# EAGLE design EMS esp32 wifi v2.4 (eagle v7) (EAGLE 7.7.0)
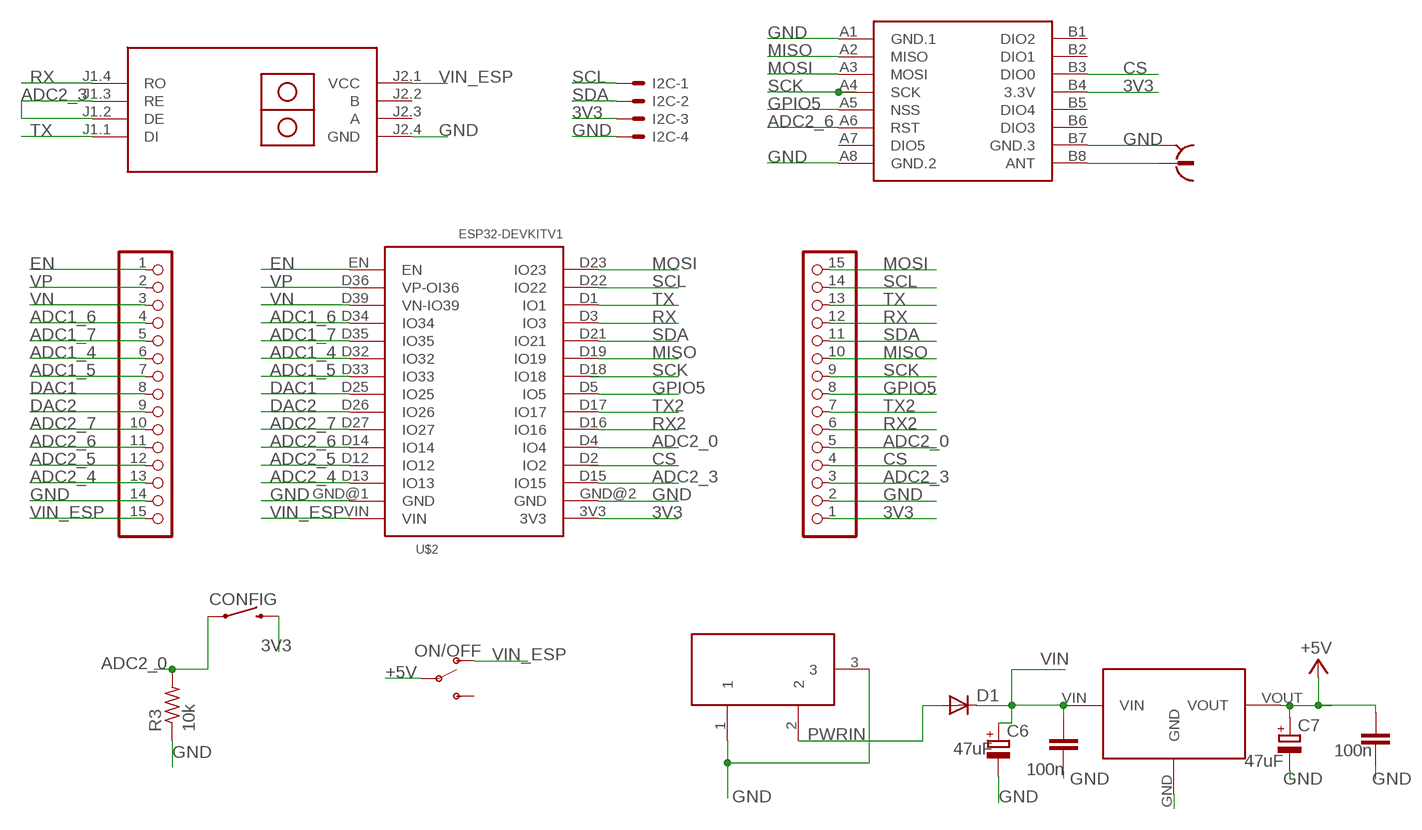
[diagram p0: schematic, sheet 1]

## Parts
C5  100n  C-EUC1206  [C1206]
C6  47uF  CPOL-EUD  [PANASONIC_D]
C7  47uF  CPOL-EUD  [PANASONIC_D]
C14  100n  C-EUC1206  [C1206]
CONFIG  MOMENTARY-SWITCH-SPST-PTH-6.0MM  [TACTILE_SWITCH_PTH_6.0MM]
D1  DIODE-SMB  [SMB]
I2C  22-23-2041  [22-23-2041]
JP1  PINHD-1X15  [1X15]
JP2  PINHD-1X15  [1X15]
ON/OFF  SWITCH-SPDT-PTH-11.6X4.0MM  [SWITCH_SPDT_PTH_11.6X4.0MM]
R3  10k  R-US_0204/7  [0204/7]
RFM95  WIRELESS-LORA-RFM95W#SMD  [WIRELESS-LORA-RFM95W#SMD]
U$1  RS485-TTL-CONVERTER  [RS485-TTL-CONVERTER]
U$2  ESP32DEVKITV1  [ESP32-DEVKITV1]
U$3  SMARTPRJ_POWERSUPPLY_DC21MMX  [SMARTPRJ_POWERSUPPLY_DC-21MM]
U$4  7805-TO263_7805  [7805-TO263_TO263]
X1  734120110  [734120110]

## Nets
3V3: CONFIG.3 I2C.3 JP2.1 RFM95.B4(3.3V) U$2.3V3
+5V [usbvcc]: C7.+ C14.2 ON/OFF.2(P) U$4.VOUT
ADC1_4: JP1.6 U$2.D32(IO32)
ADC1_5: JP1.7 U$2.D33(IO33)
ADC1_6: JP1.4 U$2.D34(IO34)
ADC1_7: JP1.5 U$2.D35(IO35)
ADC2_0: CONFIG.1 JP2.5 R3.2 U$2.D4(IO4)
ADC2_3: JP2.3 U$1.J1.2(DE) U$1.J1.3(RE) U$2.D15(IO15)
ADC2_4: JP1.13 U$2.D13(IO13)
ADC2_5: JP1.12 U$2.D12(IO12)
ADC2_6: JP1.11 RFM95.A6(RST) U$2.D14(IO14)
ADC2_7: JP1.10 U$2.D27(IO27)
CS: JP2.4 RFM95.B3(DIO0) U$2.D2(IO2)
DAC1: JP1.8 U$2.D25(IO25)
DAC2: JP1.9 U$2.D26(IO26)
EN: JP1.1 U$2.EN
GND: C5.1 C6.- C7.- C14.1 I2C.4 JP1.14 JP2.2 R3.1 RFM95.A1(GND.1) RFM95.A8(GND.2) RFM95.B7(GND.3) U$1.J2.4(GND) U$2.GND@1(GND) U$2.GND@2(GND) U$3.1 U$3.3 U$4.GND X1.S@1 X1.S@2 X1.S@3
GPIO5: JP2.8 RFM95.A5(NSS) U$2.D5(IO5)
MISO: JP2.10 RFM95.A2(MISO) U$2.D19(IO19)
MOSI: JP2.15 RFM95.A3(MOSI) U$2.D23(IO23)
N$8: RFM95.B8(ANT) X1.1
PWRIN [power]: D1.A U$3.2
RX: JP2.12 U$1.J1.4(RO) U$2.D3(IO3)
RX2: JP2.6 U$2.D16(IO16)
SCK: JP2.9 RFM95.A4(SCK) U$2.D18(IO18)
SCL: I2C.1 JP2.14 U$2.D22(IO22)
SDA: I2C.2 JP2.11 U$2.D21(IO21)
TX: JP2.13 U$1.J1.1(DI) U$2.D1(IO1)
TX2: JP2.7 U$2.D17(IO17)
VIN: C5.2 C6.+ D1.C U$4.VIN
VIN_ESP [usbvcc]: JP1.15 ON/OFF.1(O) U$1.J2.1(VCC) U$2.VIN
VN: JP1.3 U$2.D39(VN-IO39)
VP: JP1.2 U$2.D36(VP-OI36)
Unconnected: ON/OFF.3(S) RFM95.A7(DIO5) RFM95.B1(DIO2) RFM95.B2(DIO1) RFM95.B5(DIO4) RFM95.B6(DIO3) U$1.J2.2(B) U$1.J2.3(A)

## Library data of the parts
C5 C14 = rcl@1:C-EU: CAPACITOR, European symbol
C6 C7 = rcl@1:CPOL-EU: POLARIZED CAPACITOR, European symbol
CONFIG = SparkFun-Switches:MOMENTARY-SWITCH-SPST: Momentary Switch (Pushbutton) - SPST Normally-open (NO) SPST momentary switches (buttons, pushbuttons). Variants PTH-12MM - 12mm square, through-hole Momentary Pushbutton Switch - 12mm Square <https://www.sparkfun.com/products/9190> (COM-09190) PTH-6.0MM, PTH-6.0MM-KIT - 6.0mm square, through-hole Mini Pushbutton Switch <https://www.sparkfun.com/products/97> (COM-00097) KIT package intended for soldering kit's - only one side of pads' copper is exposed. PTH-RIGHT-ANGLE-KIT - Right-angle, through-hole Right Angle Tactile Button <https://www.sparkfun.com/products/10791> - Used on SparkFun BigTime Watch Kit <https://www.sparkfun.com/products/11734> SMD-12MM - 12mm square, surface-mount Tactile Button - SMD (12mm) <https://www.sparkfun.com/products/12993> (COM-12993) Used on SparkFun PicoBoard <https://www.sparkfun.com/products/11888> SMD-4.5MM - 4.5mm Square Trackball Switch Used on SparkFun Blackberry Trackballer Breakout <https://www.sparkfun.com/products/13169> SMD-4.6MMX2.8MM - 4.60mm x 2.80mm, surface mount Used on SparkFun SAMD21 Mini Breakout <https://www.sparkfun.com/products/13664> SMD-5.2MM, SMD-5.2-REDUNDANT - 5.2mm square, surface-mount Mini Pushbutton Switch - SMD <https://www.sparkfun.com/products/8720> (COM-08720) Used on Arduino Pro Mini <https://www.sparkfun.com/products/11114> REDUNDANT package connects both switch circuits together SMD-6.0X3.5MM - 6.0 x 3.5mm, surface mount Momentary Reset Switch SMD <https://www.sparkfun.com/products/8229> (COM-08229) SMD-6.2MM-TALL - 6.2mm square, surface mount Tactile Button - SMD (6mm) <https://www.sparkfun.com/products/12992> Used on SparkFun Digital Sandbox <https://www.sparkfun.com/products/12651> SMD-RIGHT-ANGLE - Right-angle, surface mount Used on SparkFun Block for Intel® Edison - Arduino <https://www.sparkfun.com/products/13036>; PROD_ID: SWCH-08441; SF_SKU: COM-00097
D1 = diode:DIODE-: DIODE
I2C = con-molex:22-23-2041: .100" (2.54mm) Center Header - 4 Pin; MF: MOLEX; MPN: 22-23-2041; OC_FARNELL: 1462920; OC_NEWARK: 38C0355
JP1 JP2 = pinhead:PINHD-1X15: PIN HEADER
ON/OFF = SparkFun-Switches:SWITCH-SPDT: Single Pole, Double Throw (SPDT) Switch Single-pole, double-throw (SPDT) switch. Variant Overview SMD-AYZ0202 Surface Mount DPDT Switch <https://www.sparkfun.com/products/597> (COM-00597) Used on e.g. LilyPad Arduino USB - ATmega32U4 Board <https://www.sparkfun.com/products/12049> PTH-11.6X4.0MM SPDT Mini Power Switch <https://www.sparkfun.com/products/102> (COM-00102) Used on e.g. SparkFun Simon Says - Through-Hole Soldering Kit <https://www.sparkfun.com/products/10547> (KIT-10547) PTH-11.6X4.0MM-KIT KIT version of SPDT Mini Power Switch - Simplifies soldering by removing tStop of switch pins - only one side can be soldered. PTH-11.6X4.0MM-LOCK LOCK version of SPDT Mini Power Switch - Offset pins hold switch in place for easier soldering. SMD-RIGHT-ANGLE Surface Mount Right Angle Switch <https://www.sparkfun.com/products/10860> (COM-10860) Used on e.g. SparkFun ESP8266 Thing <https://www.sparkfun.com/products/13231>; PROD_ID: SWCH-08261; SF_SKU: COM-00102
R3 = rcl:R-US_: RESISTOR, American symbol; SPICEPREFIX: R
RFM95 = diy-modules:WIRELESS-LORA-RFM95W: 868/915 MHz LoRa Radio Transceiver Module based on SX1276 chip Click here to find device on ebay.com <http://www.ebay.com/sch/RFM95W+transceiver>
U$1 = diy-modules:RS485-TTL-CONVERTER: RS485 to TTL converter based on MAX485 chip
U$2 = ESP32-DEVKITV1:ESP32DEVKITV1
U$3 = arduino_Uno_Rev3-02-TH:SMARTPRJ_POWERSUPPLY_DC21MM
U$4 = arduino_f:7805-TO263_7805
X1 = con-coax:734120110: MICRO COAXIAL CONNECTOR RECEPTACLE VERTICAL Source: Data sheet <http://www.molex.com/pdm_docs/sd/734120110_sd.pdf>

## Net classes
1 power: width 0.61 mm, drill 0.508 mm, clearance 0.152 mm
2 gnd: width 0.305 mm, drill 0.508 mm, clearance 0.152 mm
3 usbvcc: width 0.508 mm, drill 0.508 mm, clearance 0.152 mm

## Board
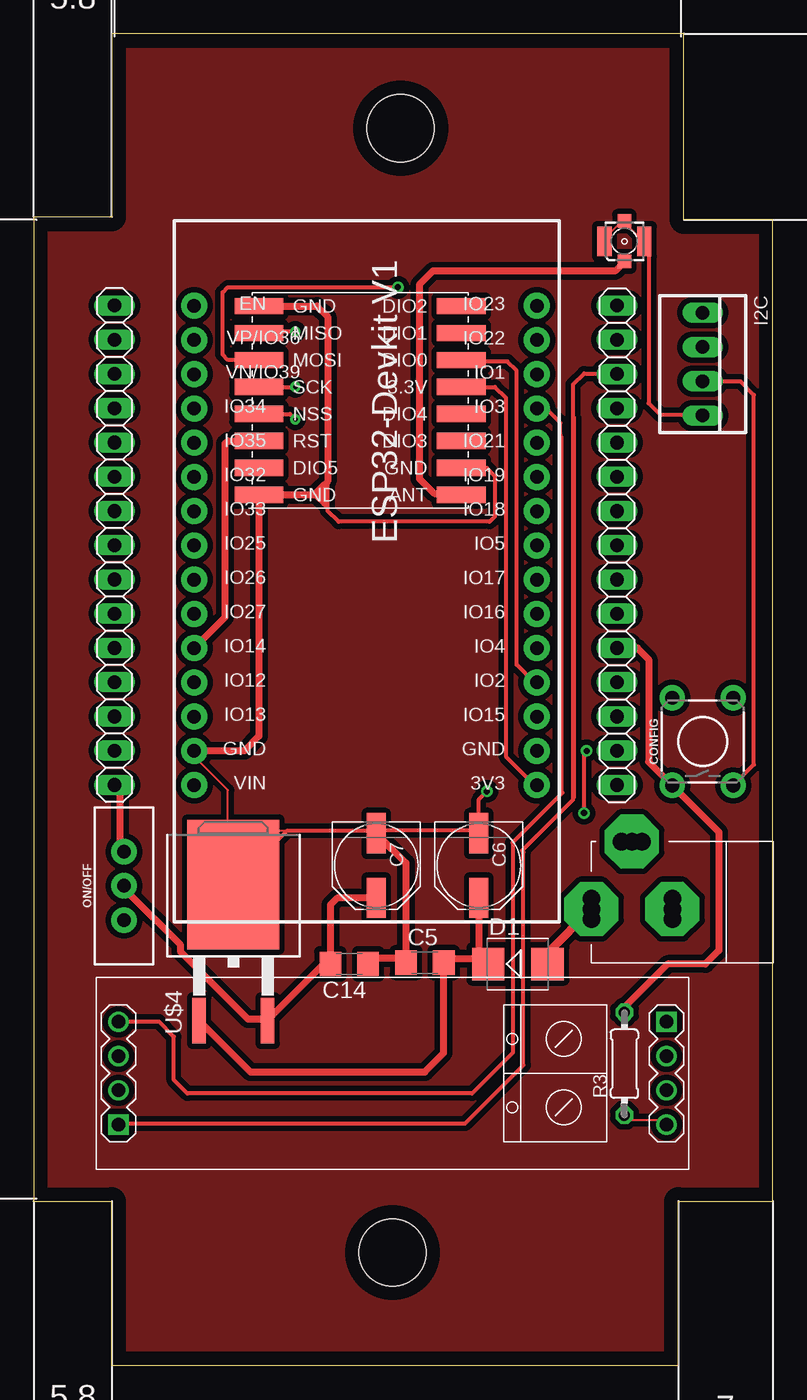
[diagram p1: board, top side]
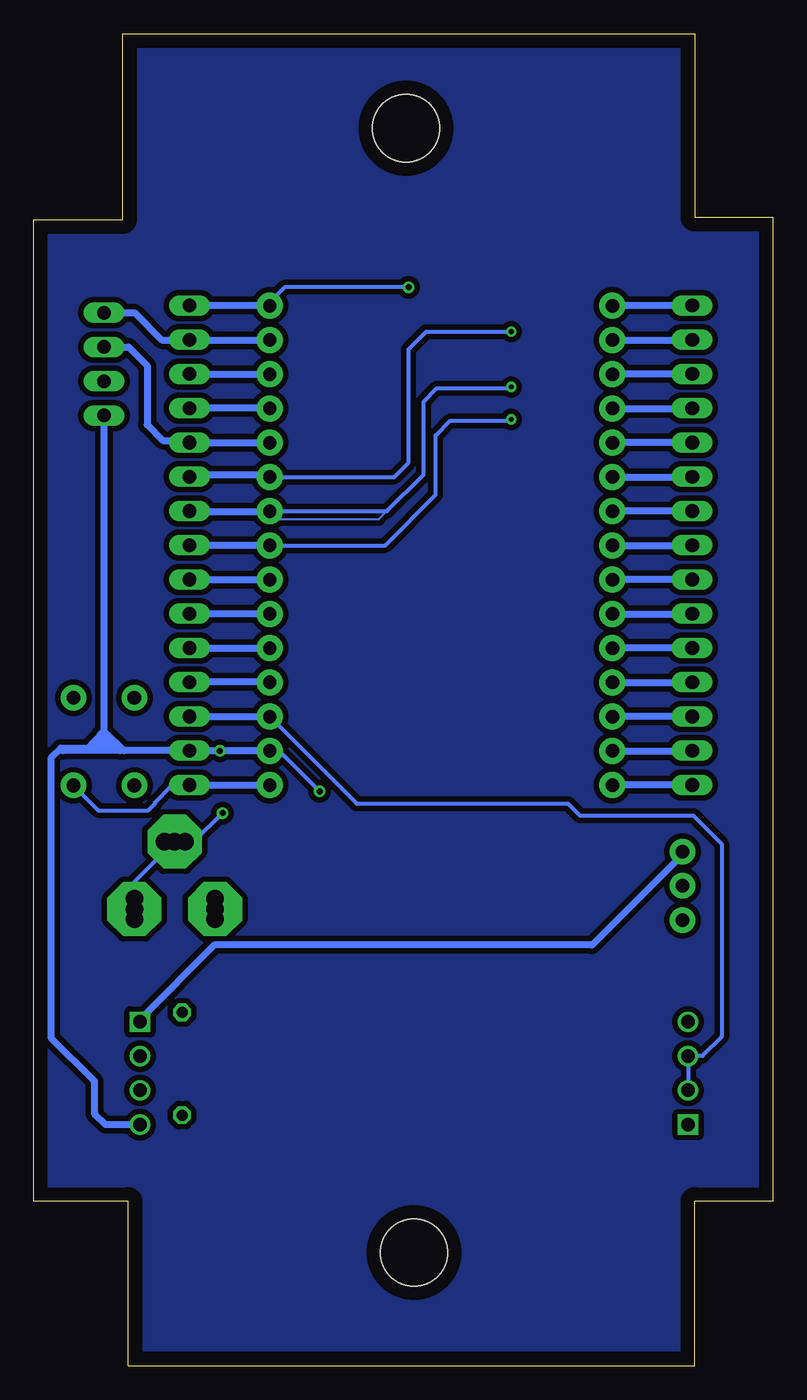
[diagram p2: board, bottom side, seen from below]

Size 54.8 x 98.8 mm. Coordinates in mm from the lower left corner, seen from the top.
Outline: 0,12.2 5.8,12.2 5.8,0 47.8,0 47.8,12.2 54.8,12.2 54.8,85 48.2,85 48.2,98.8 5.8,98.8 5.8,85.2 0,85.2 0,12.2
Copper layers (1*16): Top 0.035mm / dielectric 1.5mm / Bottom 0.035mm
Design rules "default": minimum track width 6mil, minimum drill 0.35mm, track to track 6mil, track to pad 6mil, pad to pad 6mil, via to via 6mil, smd to smd 6mil, copper to edge 40mil, drill to drill 6mil, minimum pad ring 10mil, minimum via ring 8mil, stop-mask expansion 4mil, vias tented up to drill 0mil, thermal gap 10mil
Holes 5 mm at 26.6,8.4 27.2,91.8

### Footprints (pad centres in the part's own frame; a part is rotated, then mirrored left to right if it is on the bottom)
C1206 = smd 1.6 x 1.8: 1 -1.4,0; 2 1.4,0
PANASONIC_D = smd 3 x 1.4: + 2.4,0; - -2.4,0
TACTILE_SWITCH_PTH_6.0MM = drill 1.016 pad 1.88: 1 -3.251,2.261; 2 3.251,2.261; 3 -3.251,-2.261; 4 3.251,-2.261
SMB = smd 2.4 x 2.4: A 2.2,0; C -2.2,0
22-23-2041 = drill 1 long: 1 -3.81,0; 2 -1.27,0; 3 1.27,0; 4 3.81,0
1X15 = drill 1.016 long: 1 -17.78,0; 2 -15.24,0; 3 -12.7,0; 4 -10.16,0; 5 -7.62,0; 6 -5.08,0; 7 -2.54,0; 8 0,0; 9 2.54,0; 10 5.08,0; 11 7.62,0; 12 10.16,0; 13 12.7,0; 14 15.24,0; 15 17.78,0
SWITCH_SPDT_PTH_11.6X4.0MM = drill 1.016 pad 1.88: 1 0,2.54; 2 0,0; 3 0,-2.54
0204/7 = drill 0.813 octagon: 1 -3.81,0; 2 3.81,0
WIRELESS-LORA-RFM95W#SMD = smd 3.6 x 1.2: A1 -7.5,7; A2 -7.5,5; A3 -7.5,3; A4 -7.5,1; A5 -7.5,-1; A6 -7.5,-3; A7 -7.5,-5; A8 -7.5,-7; B1 7.5,7; B2 7.5,5; B3 7.5,3; B4 7.5,1; B5 7.5,-1; B6 7.5,-3; B7 7.5,-5; B8 7.5,-7
RS485-TTL-CONVERTER = drill 1 square: J1.1 -20.32,-3.81; J2.1 20.32,3.81 | drill 1: J1.2 -20.32,-1.27; J1.3 -20.32,1.27; J1.4 -20.32,3.81; J2.2 20.32,1.27; J2.3 20.32,-1.27; J2.4 20.32,-3.81
ESP32-DEVKITV1 = drill 1 pad 1.93: 3V3 -16.52,-12.27; D1 13.96,-12.27; D2 -8.9,-12.27; D3 11.42,-12.27; D4 -6.36,-12.27; D5 1.26,-12.27; D12 -8.9,13.135; D13 -11.44,13.135; D14 -6.36,13.135; D15 -11.44,-12.27; D16 -3.82,-12.27; D17 -1.28,-12.27; D18 3.8,-12.27; D19 6.34,-12.27; D21 8.88,-12.27; D22 16.5,-12.27; D23 19.04,-12.27; D25 1.26,13.135; D26 -1.28,13.135; D27 -3.82,13.135; D32 6.34,13.135; D33 3.8,13.135; D34 11.42,13.135; D35 8.88,13.135; D36 16.5,13.135; D39 13.96,13.135; EN 19.04,13.135; GND@1 -13.98,13.135; GND@2 -13.98,-12.27; VIN -16.52,13.135
SMARTPRJ_POWERSUPPLY_DC-21MM = drill 1.3 pad 4 octagon: 1 -5.08,-3.353; 2 -0.076,-6.35; 3 -0.076,-0.356 | drill 1.3: 4 -5.08,-4.115; 5 -5.08,-2.591; 6 -0.838,-0.356; 7 0.686,-0.356; 8 -0.838,-6.35; 9 0.686,-6.35
7805-TO263_TO263 = smd 6.8 x 9.6: GND 0,3.5 | smd 1 x 3.4: VIN -2.54,-6.6; VOUT 2.54,-6.6
734120110 = smd 1 x 1: 1 0,-1.5; S@1 0,1.5 | smd 1.05 x 2.2: S@2 -1.475,0; S@3 1.475,0

### Placement (x,y rotation side)
C5  29,29.9 0 top
C6  33,37.1 270 top
C7  25.4,37.1 270 top
C14  23.4,29.8 180 top
CONFIG  49.6,46.3 90 top
D1  35.9,29.8 0 top
I2C  49.6,74.3 270 top
JP1  5.98,60.86 270 top
JP2  43.25,60.86 90 top
ON/OFF  6.7,35.6 0 top
R3  43.8,22.4 90 top
RFM95  24.2,71.6 0 top
U$1  26.6,21.7 0 top
U$2  25.03,59.59 90 top
U$3  47.7,33.8 270 top
U$4  14.8,32.2 0 top
X1  43.8,83.4 0 top

### Tracks (layer width: path | path; a pad name or v marks a point on that pad's centre or on a via)
3V3
  Top 0.152: 37.27,43.14 U$2.3V3 37.05,43.15 36.9,43.2 35.4,44.7 | 31.9,72.2 RFM95.B4
  Top 0.305: RFM95.B4 34.2,72.6 35,71.8 35,45.2 37.05,43.15 | I2C.3 52.37,73.03 53.4,72 53.4,44.59 CONFIG.3
  Bottom 0.152: 43.4,42.7 43.3,42.96 JP2.1
  Bottom 0.305: CONFIG.3 50.01,41.2 46.3,41.2 45.8,41.7 45.8,41.8 44.64,42.96 43.3,42.96
  Bottom 0.508: JP2.1 U$2.3V3
+5V
  Top 0.508: ON/OFF.2 6.9,35.2 10.9,31.2 10.9,30.7 15.9,25.7 16.9,25.7 U$4.VOUT 17.4,25.7 21.9,30.2 C14.2 22,34.2 22.5,34.7 C7.+
ADC1_4
  Top 0.152: 6.03,66 JP1.6
  Bottom 0.508: U$2.D32 JP1.6
ADC1_5
  Top 0.152: 6.03,63.41 JP1.7 | 11.82,63.41 U$2.D33
  Bottom 0.508: JP1.7 11.88,63.4 U$2.D33
ADC1_6
  Top 0.152: 11.82,71.03 U$2.D34
  Bottom 0.508: U$2.D34 JP1.4
ADC1_7
  Top 0.152: 6.03,68.51 JP1.5 | 11.82,68.51 U$2.D35
  Bottom 0.508: JP1.5 11.88,68.48 U$2.D35
ADC2_0
  Top 0.152: 43.84,26.39 R3.2 | 43.4,53.2 JP2.5 | 46.9,43.2 CONFIG.1
  Top 0.508: 43.84,26.39 43.84,26.64 47,29.8 49.8,29.8 50.8,30.8 50.8,39.59 CONFIG.1 45.6,44.79 45.6,52.4 44.76,53.24 JP2.5
  Bottom 0.508: JP2.5 U$2.D4
ADC2_3
  Bottom 0.152: 37.4,48.2 U$2.D15 | 5.9,23.2 U$1.J1.3
  Bottom 0.305: U$2.D15 30.85,41.7 15.2,41.7 14.3,40.8 5.9,40.8 3.8,38.7 3.8,24.4 5.23,22.97 U$1.J1.3 U$1.J1.2
  Bottom 0.508: JP2.3 37.44,48.16 37.4,48.2
ADC2_4
  Top 0.152: 6.03,48.17 JP1.13 | 11.82,48.17 U$2.D13
  Bottom 0.508: JP1.13 11.88,48.16 U$2.D13
ADC2_5
  Top 0.152: 6.03,50.76 JP1.12 | 11.82,50.76 U$2.D12
  Bottom 0.508: U$2.D12 JP1.12
ADC2_6
  Top 0.152: 6.03,53.27 JP1.11 | 11.82,53.27 U$2.D14 | 16.59,68.46 RFM95.A6
  Top 0.508: U$2.D14 14.2,55.53 14.2,68.4 14.4,68.6 16.45,68.6 16.59,68.46
  Bottom 0.508: JP1.11 11.88,53.24 U$2.D14
ADC2_7
  Top 0.152: 11.82,55.79 U$2.D27
  Bottom 0.508: U$2.D27 JP1.10
B
  pour Bottom (isolate 0.406): 0.2,12.4 6,12.4 6,0.2 47.6,0.2 47.6,12.4 54.6,12.4 54.6,84.8 48,84.8 48,98.6 6,98.6 6,85 0.2,85
CS
  Top 0.152: 31.9,74.2 31.76,74.48 RFM95.B3 | 36.9,50.7 U$2.D2
  Top 0.305: U$2.D2 37.11,50.69 35.8,52 35.8,73.8 35.12,74.48 31.76,74.48
  Bottom 0.508: U$2.D2 JP2.4
DAC1
  Top 0.152: 6.03,60.89 JP1.8 | 11.82,60.89 U$2.D25
  Bottom 0.508: U$2.D25 JP1.8
DAC2
  Top 0.152: 6.03,58.38 JP1.9 | 11.82,58.38 U$2.D26
  Bottom 0.508: JP1.9 11.88,58.32 U$2.D26
EN
  Top 0.152: 6.03,78.65 JP1.1 | 11.82,78.65 U$2.EN
  Bottom 0.508: JP1.1 11.88,78.64 U$2.EN
GND  (via drill 0.45)
  Top 0.152: 6.03,45.65 JP1.14 | 11.82,45.65 U$2.GND@1 | C14.1 24.9,30.2 25,30.2 27.4,30.2 C5.1 | 26.4,38.2 25.4,39.2 C7.- 25.4,39.7 | 14.4,39.7 14.4,35.7 U$4.GND 14.4,39.7 | 14.4,39.7 14.4,42.7 11.9,45.2 U$2.GND@1 | 16.4,64.2 RFM95.A8 | 11.9,45.7 U$2.GND@1 | 14.4,39.7 19,39.7 | X1.S@3 44.9,83.7 43.9,84.7 X1.S@1 43.4,84.7 42.4,83.7 X1.S@2 | 49.55,70.54 I2C.4 | R3.1 43.9,18.2 46.9,18.2 U$1.J2.4 | 33.4,39.7 C6.- | 37.4,45.2 U$2.GND@2
  Top 0.305: X1.S@3 45.6,83.08 45.6,71.4 46.46,70.54 49.55,70.54 | v40.8,41 40.8,45.41 v41,45.61 | U$4.GND 18.8,39.7 19,39.7 25.4,39.7 32.8,39.7 C6.- 33,42 v33.6,42.6 | RFM95.B7 33.6,66.6 34.2,66 34.2,63 33.8,62.6 22.6,62.6 21.8,63.4 21.8,63.6 | 21.8,63.6 21.8,65.6 | 20.8,64.6 21.1,64.3 | 21.1,64.3 21.3,64.1 | 21.3,64.1 21.5,63.9 | 21.5,63.9 21.8,63.6 | 21.5,63.9 21.5,65.1 21.4,65.2 21.4,64.2 21.3,64.1 | 21.1,64.9 21.1,64.3
  Top 0.508: 25,30.2 27.3,30.2 C5.1 27.6,37.3 C7.- | U$2.GND@1 15.61,45.61 16.7,46.7 RFM95.A8 20.8,64.6 21.1,64.9 21.4,65.2 21.8,65.6 21.8,77.8 21,78.6 RFM95.A1
  Bottom 0.152: 37.27,45.58 U$2.GND@2 37.4,45.7 42.9,45.7 JP2.2 43.27,45.55 43.4,45.2 | 50.4,21.2 50.3,21.1
  Bottom 0.305: U$3.3 47.34,35.88 U$3.1 42.92,38.88 v40.8,41 | v33.6,42.6 36.58,45.58 37.27,45.58
  Bottom 0.508: U$2.GND@1 JP1.14 | U$2.GND@2 v41,45.61 43.22,45.61 43.27,45.55 | I2C.4 49.6,47.1 | 49.6,47.1 49.75,46.95 | 49.75,46.95 49.9,46.8 | JP2.2 48.12,45.62 | 48.12,45.62 48.42,45.62 | 49.75,46.95 49.2,46.4 | 49.2,46.4 49.1,46.3 | 49.1,46.3 48.8,46 | 48.8,46 48.42,45.62 | 49.6,47.1 49.6,47 50.2,46.4 | 50.8,45.8 50.3,46.3 | 50.8,45.8 52.8,45.8 | 48.42,45.62 52.62,45.62 52.8,45.8 | 50.8,45.8 49.4,45.8 | 49.4,45.8 49,45.8 48.8,46 | 49.2,46.4 49.8,46.4 | 49.8,46.4 50.2,46.4 | 50.2,46.4 50.3,46.3 | 50.3,46.3 49.9,46.3 49.4,45.8 | 49.8,46.4 49.7,46.3 49.1,46.3 | 49.6,47.1 48.12,45.62 | 50.4,21.2 53.53,24.33 53.53,45.07 52.8,45.8 | 50.3,21.1 50.3,18.7 49.49,17.89 U$1.J2.4
GPIO5  (via drill 0.35)
  Top 0.305: RFM95.A5 19,70.6 v19.4,70.2
  Bottom 0.152: 43.19,60.83 JP2.8 | 19.5,70.1 v19.4,70.2
  Bottom 0.305: U$2.D5 28.75,60.85 25,64.6 25,69 23.9,70.1 19.5,70.1
  Bottom 0.508: U$2.D5 43.17,60.85 43.19,60.83
MISO  (via drill 0.35)
  Top 0.152: 18,76.7 16.9,76.7 RFM95.A2
  Top 0.305: v19.4,76.7 18,76.7
  Bottom 0.152: 43.06,66.08 JP2.10
  Bottom 0.305: U$2.D19 28.07,65.93 27,67 27,75.4 25.7,76.7 v19.4,76.7
  Bottom 0.508: U$2.D19 37.45,66.08 43.06,66.08
MOSI  (via drill 0.45)
  Top 0.152: 43.22,78.65 JP2.15 42.9,78.7 | 37.35,78.65 U$2.D23 37.4,78.7
  Top 0.305: RFM95.A3 14.4,74.6 14,75 14,79.6 14.4,80 v27,80
  Bottom 0.305: v27,80 36.2,80 37.3,78.9 U$2.D23
  Bottom 0.508: U$2.D23 JP2.15
N$8
  Top 0.152: 31.2,64.7 31.4,64.7 RFM95.B8
  Top 0.508: X1.1 43.1,81.2 29.6,81.2 28.6,80.2 28.6,65.8 29.7,64.7 31.2,64.7
PWRIN
  Top 0.61: U$3.2 38.1,30.63 D1.A
RX
  Top 0.152: 37.35,71.03 U$2.D3 37.35,70.85 | 43.22,71.03 JP2.12 | 39.2,42.5 39.2,68.9 39.05,69.05 | 6.4,25.2 U$1.J1.4
  Top 0.305: U$1.J1.4 9.29,25.51 10.4,24.4 10.4,21.2 11.4,20.2 32.5,20.2 35.5,23.2 35.5,38.8 39.2,42.5 39.05,42.65 39.05,69.05 39.05,69.95 38.15,70.85 37.35,70.85
  Bottom 0.508: U$2.D3 JP2.12
RX2
  Bottom 0.508: U$2.D16 JP2.6
SCK  (via drill 0.35)
  Top 0.305: RFM95.A4 v19.4,72.6
  Bottom 0.152: JP2.9 42.9,63.2 37.4,63.2 U$2.D18 37.25,63.34 36.71,62.8 29.2,62.8 25.9,66.1 | 19.5,72.5 v19.4,72.6
  Bottom 0.305: U$2.D18 28.61,63.39 25.9,66.1 25.9,71.5 24.9,72.5 19.5,72.5
  Bottom 0.508: JP2.9 43.2,63.34 37.25,63.34
SCL
  Top 0.152: 43.29,76.13 JP2.14 | 37.35,76.13 U$2.D22 37.4,76.2 | 43.22,76.13 JP2.14 | 42.9,76.2 JP2.14
  Bottom 0.152: 49.4,77.7 I2C.1 | 43.4,76.2 JP2.14
  Bottom 0.508: JP2.14 | JP2.14 U$2.D22 | I2C.1 47.31,78.11 45.29,76.09 JP2.14
SDA
  Top 0.152: 37.35,68.51 U$2.D21 | 43.22,68.51 JP2.11
  Bottom 0.152: 43.29,68.51 JP2.11 43.35,68.63 | 37.33,68.54 U$2.D21
  Bottom 0.508: JP2.11 37.39,68.48 37.33,68.54 | I2C.2 47.77,75.57 46.4,74.2 46.4,69.8 45.23,68.63 43.35,68.63
T
  pour Top (isolate 0.406): 0.2,12.4 6,12.4 6,0.2 47.6,0.2 47.6,12.4 54.6,12.4 54.6,84.8 48,84.8 48,98.6 6,98.6 6,85 0.2,85
TX
  Top 0.152: 37.35,73.54 U$2.D1 37.4,73.2 | 43.22,73.54 JP2.13 42.9,73.2 | 40,42 40.1,42.1 40.1,70.4 | 6.31,17.96 U$1.J1.1
  Top 0.305: 6.31,17.96 31.96,17.96 36.3,22.3 36.3,38.1 36.2,38.2 40,42 40,72.8 40.8,73.6 43.2,73.6 JP2.13
  Bottom 0.508: JP2.13 U$2.D1
TX2
  Bottom 0.508: JP2.7 U$2.D17
VIN
  Top 0.152: 32.9,30.2 33,30.2 33.4,30.2 D1.C 32.9,30.2 | 32.9,30.2 30.4,30.2 C5.2 30.4,29.4 | 32.9,30.6 32.9,30.2
  Top 0.508: U$4.VIN 16.06,21.8 29,21.8 30.4,23.2 30.4,29.4 | C5.2 30.7,30.2 33,30.2 | C6.+ 33,30.7 32.9,30.6
VIN_ESP
  Top 0.152: 6.03,43.14 JP1.15 | 6.66,38.09 ON/OFF.1
  Top 0.508: JP1.15 6.4,42.7 6.4,38.2 ON/OFF.1
  Bottom 0.508: U$1.J2.1 46.9,25.7 41.4,31.2 13.4,31.2 6.9,37.7 ON/OFF.1 | JP1.15 11.88,43.08 U$2.VIN
VN
  Top 0.152: 6.03,73.62 JP1.3 | 11.82,73.62 U$2.D39
  Bottom 0.508: JP1.3 11.88,73.56 U$2.D39
VP
  Top 0.152: 6.03,76.13 JP1.2 | 11.82,76.13 U$2.D36
  Bottom 0.508: U$2.D36 JP1.2